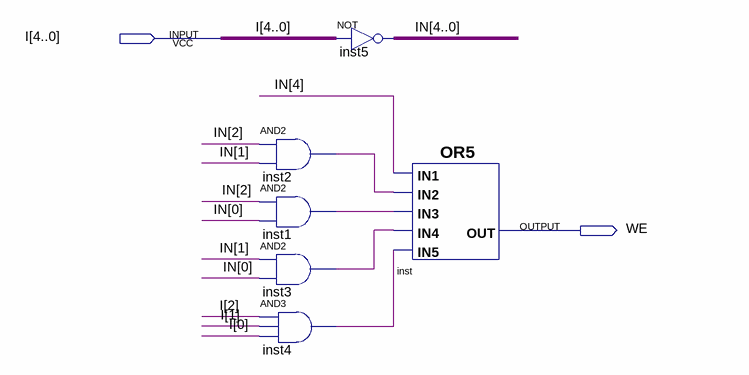
[diagram p0: schematic sheet]
// Quartus schematic WE.bdf as structural Verilog: 6 symbols, 2 pins
module WE (
  input  [4:0] I,
  output WE
);

  wire inst1_out, inst2_out, inst3_out, inst4_out;
  wire [4:0] IN;

  and inst2 (inst2_out, IN[2], IN[1]);
  and inst1 (inst1_out, IN[2], IN[0]);
  and inst3 (inst3_out, IN[1], IN[0]);
  and inst4 (inst4_out, I[2], I[1], I[0]);
  assign IN = ~I;  // NOT inst5, 5 bits wide
  or inst (WE, IN[4], inst2_out, inst1_out, inst3_out, inst4_out);
endmodule
